# Altium schematic sheet V4.0.SchDoc: 独轮平衡车电路图
size A4; Revision: V0.0
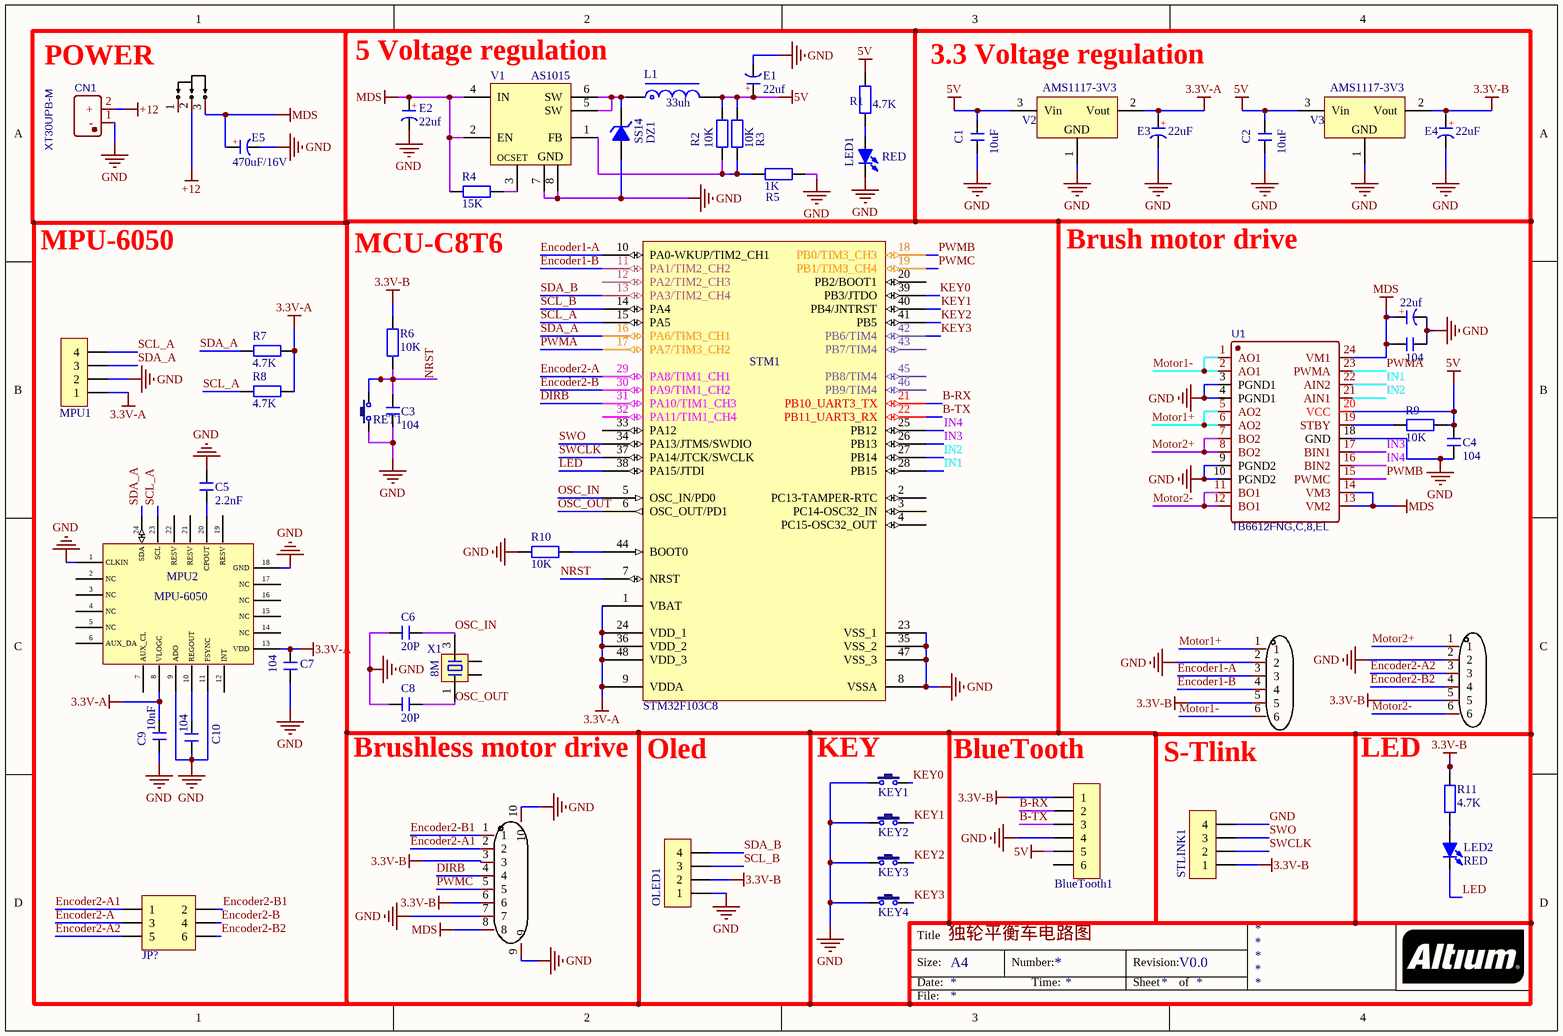
[diagram p0: V4.0.SchDoc]

## Parts
1  22uf  [CD C(6032)]
2  104  [C 0805_M]
BlueTooth1  HDR-1X6  [HDR2.54-M-LI-6P]  (value not drawn)
C1  10uF  [C 0805_M]
C2  10uF  [C 0805_M]
C3  104  [C 0805_L]
C4  104  [C 0805_M]
C5  2.2nF  [C 1206_M]
C6  20P  [C 0603_M]
C7  104  [C 0805_L]
C8  20P  [C 0603_M]
C9  10nF  [C 0805_L]
C10  104  [C 0805_L]
CN1  XT30UPB-M  [XT30_M]
DZ1  SS14  [SMA]
E1  22uf  [CD C(6032)]
E2  22uf  [CD C(6032)]
E3  22uF  [CD A(3216)]
E4  22uF  [CD A(3216)]
E5  470uF/16V  [CS 3.5*8*11.5 - V]
JP?  Header3X2  [HDR2.54-LI-2x3P]  (value not drawn)
KEY1  3x6x5  [TSW SMD-3*6*2.5]  (value not drawn)
KEY2  3x6x5  [TSW SMD-3*6*2.5]  (value not drawn)
KEY3  3x6x5  [TSW SMD-3*6*2.5]  (value not drawn)
KEY4  3x6x5  [TSW SMD-3*6*2.5]  (value not drawn)
L1  33uh  [CD 0630]
LED1  RED  [LED 0805G]
LED2  RED  [LED 0805G]
MPU1  HDR-1X4  [HDR2.54-M-LI-4P]  (value not drawn)
MPU2  MPU-6050  [QFN24-4x4]
OLED1  HDR-1X4  [HDR2.54-M-LI-4P]  (value not drawn)
P1  HDGC2001WR-6P  [PH2.0-6P]  (value not drawn)
P2  HDGC2001WR-6P  [PH2.0-6P]  (value not drawn)
P3  1.5K-BH-8PB  [ZH1.5-8P]  (value not drawn)
R1  4.7K  [R 0805_M]
R2  10K  [R 0805_L]
R3  10K  [R 0805_L]
R4  15K  [R 0805_L]
R5  1K  [R 0805_L]
R6  10K  [R 0805_L]
R7  4.7K  [R 0805_M]
R8  4.7K  [R 0805_M]
R9  10K  [R 0805_M]
R10  10K  [R 0805_L]
R11  4.7K  [R 0805_M]
RET1  3x6x5  [TSW SMD-3*6*2.5]  (value not drawn)
STLINK1  HDR-1X4  [HDR2.54-M-LI-4P]  (value not drawn)
STM1  STM32F103C8  [LQFP48 7X7_M]
SW1  SS12D10G4 071  [SS12D]  (value not drawn)
U1  TB6612FNG,C,8,EL  [SSOP24_M]
V1  AS1015  [SOP8_L]
V2  AMS1117-3V3  [SOT223_M]
V3  AMS1117-3V3  [SOT223_M]
X1  8M  [OSC 5032-4P]

## Nets
3.3V-A: C7.1 C9.1 E3.1(A) MPU1.1 MPU2.8(VLOGC) MPU2.13(VDD) R7.2 R8.2 STM1.1(VBAT) STM1.9(VDDA) STM1.24(VDD_1) STM1.36(VDD_2) STM1.48(VDD_3) V2.2(Vout)
3.3V-B: BlueTooth1.1 E4.1(A) OLED1.2 P1.5 P2.5 P3.3 P3.6 R6.2 R11.1 STLINK1.1 V3.2(Vout)
5V: BlueTooth1.5 C1.1 C2.1 C4.2 E1.1(A) L1.2 R1.1 R2.1 R3.1 R9.2 U1.20(VCC) V2.3(Vin) V3.3(Vin)
+12: CN1.2(+) SW1.2
GND: 1.2(K) 2.2 BlueTooth1.4 C1.2 C2.2 C3.2 C4.1 C5.2 C6.2 C7.2 C8.2 C9.2 C10.2 CN1.1(-) DZ1.1(A) E1.2(K) E2.2(K) E3.2(K) E4.2(K) E5.2(K) KEY1.1 KEY2.1 KEY3.1 KEY4.1 LED1.2(K) MPU1.2 MPU2.1(CLKIN) MPU2.9(ADO) MPU2.11(FSYNC) MPU2.18(GND) OLED1.1 P1.2 P2.2 P3.7 P3.9 P3.10 R5.1 R10.2 RET1.1 STLINK1.4 STM1.8(VSSA) STM1.23(VSS_1) STM1.35(VSS_2) STM1.47(VSS_3) U1.3(PGND1) U1.4(PGND1) U1.9(PGND2) U1.10(PGND2) U1.18(GND) V1.7(GND) V1.8(GND) V2.1(GND) V3.1(GND)
MDS: 1.1(A) 2.1 E2.1(A) E5.1(A) P3.8 R4.1 SW1.3 U1.13(VM2) U1.14(VM3) U1.24(VM1) V1.2(EN) V1.4(IN)
B-RX: BlueTooth1.2 STM1.21(PB10_UART3_TX)
B-TX: BlueTooth1.3 STM1.22(PB11_UART3_RX)
DIRB: P3.4 STM1.31(PA10/TIM1_CH3)
Encoder1-A: P2.3 STM1.10(PA0-WKUP/TIM2_CH1)
Encoder1-B: P2.4 STM1.11(PA1/TIM2_CH2)
Encoder2-A: JP?.3 STM1.29(PA8/TIM1_CH1)
Encoder2-A1: JP?.1 P3.2
Encoder2-A2: JP?.5 P1.3
Encoder2-B: JP?.4 STM1.30(PA9/TIM1_CH2)
Encoder2-B1: JP?.2 P3.1
Encoder2-B2: JP?.6 P1.4
IN1: STM1.28(PB15) U1.22(AIN2)
IN2: STM1.27(PB14) U1.21(AIN1)
IN3: STM1.26(PB13) U1.17(BIN1)
IN4: STM1.25(PB12) U1.16(BIN2)
KEY0: KEY1.2 STM1.39(PB3/JTDO)
KEY1: KEY2.2 STM1.40(PB4/JNTRST)
KEY2: KEY3.2 STM1.41(PB5)
KEY3: KEY4.2 STM1.42(PB6/TIM4)
LED: LED2.2(K) STM1.38(PA15/JTDI)
Motor1+: P2.1 U1.5(AO2) U1.6(AO2)
Motor1-: P2.6 U1.1(AO1) U1.2(AO1)
Motor2+: P1.1 U1.7(BO2) U1.8(BO2)
Motor2-: P1.6 U1.11(BO1) U1.12(BO1)
NRST: C3.1 R6.1 RET1.2 STM1.7(NRST)
OSC_IN: C6.1 STM1.5(OSC_IN/PD0) X1.3
OSC_OUT: C8.1 STM1.6(OSC_OUT/PD1) X1.1
PWMA: STM1.17(PA7/TIM3_CH2) U1.23(PWMA)
PWMB: STM1.18(PB0/TIM3_CH3) U1.15(PWMC)
PWMC: P3.5 STM1.19(PB1/TIM3_CH4)
SCL_A: MPU1.4 MPU2.23(SCL) R8.1 STM1.15(PA5)
SCL_B: OLED1.3 STM1.14(PA4)
SDA_A: MPU1.3 MPU2.24(SDA) R7.1 STM1.16(PA6/TIM3_CH1)
SDA_B: OLED1.4 STM1.13(PA3/TIM2_CH4)
SWCLK: STLINK1.2 STM1.37(PA14/JTCK/SWCLK)
SWO: STLINK1.3 STM1.34(PA13/JTMS/SWDIO)
NetC5_1: C5.1 MPU2.20(CPOUT)
NetC10_1: C10.1 MPU2.10(REGOUT)
NetDZ1_2: DZ1.2(K) L1.1 V1.5(SW) V1.6(SW)
NetLED1_1: LED1.1(A) R1.2
NetLED2_1: LED2.1(A) R11.2
NetR2_2: R2.2 R3.2 R5.2 V1.1(FB)
NetR4_2: R4.2 V1.3(OCSET)
NetR9_1: R9.1 U1.19(STBY)
NetR10_1: R10.1 STM1.44(BOOT0)

Not connected (* = marked no-connect by the designer): BlueTooth1 6; MPU2 2(NC) 3(NC) 4(NC) 5(NC) 6(AUX_DA) 7(AUX_CL) 12(INT) 14(NC) 15(NC) 16(NC) 17(NC) 19(RESV) 21(RESV) 22(RESV); STM1 2(PC13-TAMPER-RTC) 3(PC14-OSC32_IN) 4(PC15-OSC32_OUT) 12(PA2/TIM2_CH3) 20(PB2/BOOT1) 32(PA11/TIM1_CH4) 33(PA12) 43(PB7/TIM4) 45(PB8/TIM4) 46(PB9/TIM4); SW1 1; X1 2 4

## Notes on the sheet
- POWER
- 5 Voltage regulation
- 3.3 Voltage regulation
- MPU-6050
- (near R4) MCU-C8T6
- Brush motor drive
- Brushless motor drive
- (near STM1) Oled
- (near KEY1) KEY
- (near BlueTooth1) BlueTooth
- (near P2) S-Tlink
- LED
- Title
- Size:
- Date:
- A4
- Number:
- Time:
- Revision:
- Sheet
- of
- File:
- (in symbol C-CD) +
- (in symbol C-CS) +

## Library data of the parts
1 E1-E4 = C-CD: 贴片钽电容; 版权归属: 源创客; BOM名称: 贴片钽电容; 学习资源: www.ooocke.com
2 C3-C10 = C: 无极性贴片电容; 版权归属: 源创客; BOM名称: 无极性贴片电容; 学习资源: www.ooocke.com
BlueTooth1 = Header 6: 6P接插件; 版权归属: 源创客; BOM名称: 6P接插件; 学习资源: www.ooocke.com
C1 C2 = C-CC: 直插瓷片电容; 版权归属: 源创客; BOM名称: 直插瓷片电容; 学习资源: www.ooocke.com
CN1 = XT30UPB-M: BOM_Manufacturer: Changzhou Amass Elec; Contributor: LCSC; BOM_Supplier: LCSC; BOM_Supplier Part: C428721; BOM_Manufacturer Part: XT30UPB-M; spicePre: C; spiceSymbolName: XT30UPB-M
DZ1 = 1N4733: 5.1V/1W稳压管; 版权归属: 源创客; BOM名称: 5.1V/1W稳压管; 学习资源: www.ooocke.com
E5 = C-CS: 直插固态电容; 版权归属: 源创客; BOM名称: 直插固态电容; 学习资源: www.ooocke.com
JP? = Header 3X2: 3*2P接插件; 版权归属: 源创客; BOM名称: 3*2P接插件; 学习资源: www.ooocke.com
KEY1-KEY4 RET1 = TSW 3x6: 3x6轻触开关; 版权归属: 源创客; BOM名称: 3x6轻触开关; 学习资源: www.ooocke.com
L1 = L-CD: 贴片功率电感; BOM名称: 功率电感; 版权归属: 黎明电子style; 学习资源: https://lmdzstyle.taobao.com/
LED1 LED2 = LED-SMD: 贴片LED; 版权归属: 源创客; BOM名称: 贴片LED; 学习资源: www.ooocke.com
MPU1 OLED1 STLINK1 = Header 4: 4P接插件; 版权归属: 源创客; BOM名称: 4P接插件; 学习资源: www.ooocke.com
P1 P2 = PH2.0-6P: 接插件; Manufacturer: HDGC(华德共创); Add into BOM: yes; Name: HDGC2001WR-6P; Symbol: HDGC2001WR-6P; Device: HDGC2001WR-6P; LCSC Part Name: PH2.0弯针 6P; Supplier Part: C5175243; Manufacturer Part: HDGC2001WR-6P; Supplier Footprint: 弯插,P=2mm; JLCPCB Part Class: Extended Part; Datasheet: https://atta.szlcsc.com/upload/public/pdf/source/20220916/36534CA64A2134C65DEF28B604EC5CCB.pdf; Supplier: LCSC; Convert to PCB: yes
P3 = ZH1.5-8P: 立贴ZH 1.5MM 8P 接线端子; Manufacturer: HDGC(华德共创); Add into BOM: yes; Name: 1.5K-BH-8PB; Symbol: 1.5K-BH-8PB; Device: 1.5K-BH-8PB; LCSC Part Name: 1x8P 间距P=1.5mm 立式 SMT; Supplier Part: C2919598; Manufacturer Part: 1.5K-BH-8PB; Supplier Footprint: SMD,P=1.5mm; JLCPCB Part Class: Extended Part; Datasheet: https://atta.szlcsc.com/upload/public/pdf/source/20211115/941864E8DB7AD29C63C657681A86366D.pdf; Supplier: LCSC; Convert to PCB: yes
R1-R11 = R: 贴片电阻; 版权归属: 源创客; BOM名称: 贴片电阻; 学习资源: www.ooocke.com
STM1 = STM32F103C8: Flaah:64/RAM:20/IO:36; BOM名称: 32位STM单片机; 版权归属: 源创客; 学习资源: www.ooocke.com
SW1 = SS12D: SS12D一路开关 12.7*6.7*6.4mm; Manufacturer: SHOU HAN(首韩); Add into BOM: yes; Name: SS12D10G4 071; Symbol: SS12D10G4 071; Device: SS12D10G4 071; LCSC Part Name: SS12D10G4 071; Supplier Part: C2887259; Manufacturer Part: SS12D10G4 071; Supplier Footprint: 插件; JLCPCB Part Class: Extended Part; Datasheet: https://atta.szlcsc.com/upload/public/pdf/source/20210820/80D1704BBF3FCEE0435FCAA54C61E0A3.pdf; Supplier: LCSC; Convert to PCB: yes
U1 = TB6612FNG,C,8,EL: BOM_Manufacturer: TOSHIBA; Contributor: LCSC; SMT Type: Extend; BOM_Supplier: LCSC; BOM_Manufacturer Part: TB6612FNG,C,8,EL; BOM_Supplier Part: C141517; BOM_JLCPCB SMD: Yes; spicePre: U; spiceSymbolName: TB6612FNG,C,8,EL
V1 = AS1015: 可调升压芯片; 版权归属: 源创客; BOM名称: 可调升压芯片; 学习资源: www.ooocke.com
V2 V3 = AMS1117: 三端稳压芯片; BOM名称: 稳压芯片; 版权归属: 源创客; 学习资源: www.ooocke.com
X1 = XTAL-4P: 4脚无源晶振; 版权归属: 源创客; BOM名称: 4脚无源晶振; 学习资源: www.ooocke.com